# Altium schematic sheet fpga-bank6.SchDoc: CS - FPGA - Bank 6
size Letter; CheckedBy: J. Brinton; CompanyName: Signal Laboratories, Inc.; DrawnBy: J. Brinton; Engineer: J. Brinton; Address1: 3479 Edison Way; Address2: Menlo Park CA 94025; Address3: +1 (877) 778-8435; Address4: siglabs.com; Revision: 3; SheetNumber: 10; SheetTotal: 47
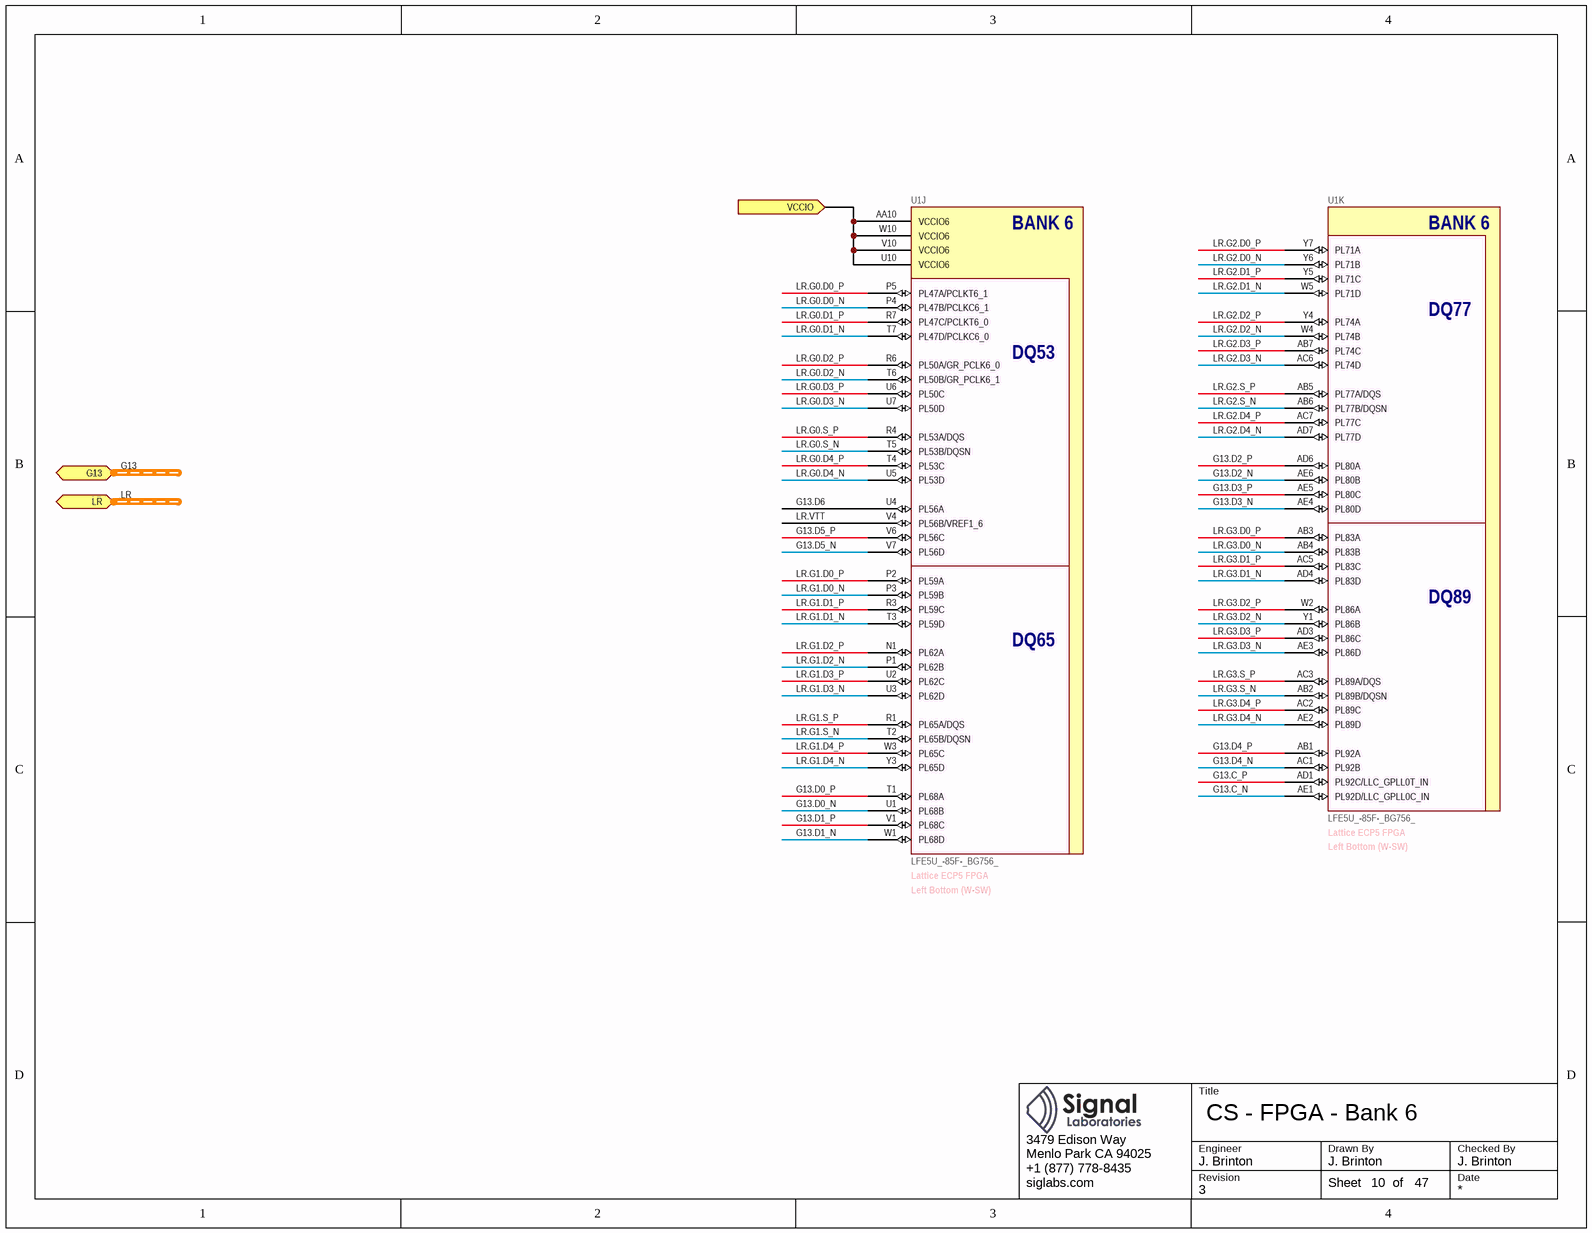
[diagram p0: fpga-bank6.SchDoc]

## Parts
U1  LFE5U_-85F-_BG756_  [caBGA756]  (parts J,K of 19)

## Ports
G13 (harness GPIO13), LR (harness DDR), VCCIO (in)

## Nets
G13.C_N: U1.AE1(PL92D/LLC_GPLL0C_IN)
G13.C_P: U1.AD1(PL92C/LLC_GPLL0T_IN)
G13.D0_N: U1.U1(PL68B)
G13.D0_P: U1.T1(PL68A)
G13.D1_N: U1.W1(PL68D)
G13.D1_P: U1.V1(PL68C)
G13.D2_N: U1.AE6(PL80B)
G13.D2_P: U1.AD6(PL80A)
G13.D3_N: U1.AE4(PL80D)
G13.D3_P: U1.AE5(PL80C)
G13.D4_N: U1.AC1(PL92B)
G13.D4_P: U1.AB1(PL92A)
G13.D5_N: U1.V7(PL56D)
G13.D5_P: U1.V6(PL56C)
G13.D6: U1.U4(PL56A)
LR.G0.D0_N: U1.P4(PL47B/PCLKC6_1)
LR.G0.D0_P: U1.P5(PL47A/PCLKT6_1)
LR.G0.D1_N: U1.T7(PL47D/PCLKC6_0)
LR.G0.D1_P: U1.R7(PL47C/PCLKT6_0)
LR.G0.D2_N: U1.T6(PL50B/GR_PCLK6_1)
LR.G0.D2_P: U1.R6(PL50A/GR_PCLK6_0)
LR.G0.D3_N: U1.U7(PL50D)
LR.G0.D3_P: U1.U6(PL50C)
LR.G0.D4_N: U1.U5(PL53D)
LR.G0.D4_P: U1.T4(PL53C)
LR.G0.S_N: U1.T5(PL53B/DQSN)
LR.G0.S_P: U1.R4(PL53A/DQS)
LR.G1.D0_N: U1.P3(PL59B)
LR.G1.D0_P: U1.P2(PL59A)
LR.G1.D1_N: U1.T3(PL59D)
LR.G1.D1_P: U1.R3(PL59C)
LR.G1.D2_N: U1.P1(PL62B)
LR.G1.D2_P: U1.N1(PL62A)
LR.G1.D3_N: U1.U3(PL62D)
LR.G1.D3_P: U1.U2(PL62C)
LR.G1.D4_N: U1.Y3(PL65D)
LR.G1.D4_P: U1.W3(PL65C)
LR.G1.S_N: U1.T2(PL65B/DQSN)
LR.G1.S_P: U1.R1(PL65A/DQS)
LR.G2.D0_N: U1.Y6(PL71B)
LR.G2.D0_P: U1.Y7(PL71A)
LR.G2.D1_N: U1.W5(PL71D)
LR.G2.D1_P: U1.Y5(PL71C)
LR.G2.D2_N: U1.W4(PL74B)
LR.G2.D2_P: U1.Y4(PL74A)
LR.G2.D3_N: U1.AC6(PL74D)
LR.G2.D3_P: U1.AB7(PL74C)
LR.G2.D4_N: U1.AD7(PL77D)
LR.G2.D4_P: U1.AC7(PL77C)
LR.G2.S_N: U1.AB6(PL77B/DQSN)
LR.G2.S_P: U1.AB5(PL77A/DQS)
LR.G3.D0_N: U1.AB4(PL83B)
LR.G3.D0_P: U1.AB3(PL83A)
LR.G3.D1_N: U1.AD4(PL83D)
LR.G3.D1_P: U1.AC5(PL83C)
LR.G3.D2_N: U1.Y1(PL86B)
LR.G3.D2_P: U1.W2(PL86A)
LR.G3.D3_N: U1.AE3(PL86D)
LR.G3.D3_P: U1.AD3(PL86C)
LR.G3.D4_N: U1.AE2(PL89D)
LR.G3.D4_P: U1.AC2(PL89C)
LR.G3.S_N: U1.AB2(PL89B/DQSN)
LR.G3.S_P: U1.AC3(PL89A/DQS)
LR.VTT: U1.V4(PL56B/VREF1_6)
VCCIO: U1.AA10(VCCIO6) U1.U10(VCCIO6) U1.V10(VCCIO6) U1.W10(VCCIO6) ; port VCCIO

## Buses and harness runs
harness G13 = port G13
harness LR = port LR

## Notes on the sheet
- (near U1) Left Bottom (W-SW)
- (near U1) Lattice ECP5 FPGA
- Title
- Engineer
- Revision
- Drawn By
- Checked By
- Date
- Sheet
- of
- (in symbol LFE5U_-85F-_BG756_, part J) BANK 6; DQ53; DQ65
- (in symbol LFE5U_-85F-_BG756_, part K) BANK 6; DQ77; DQ89

## Library data of the parts
U1 = LFE5U_-85F-_BG756_: ECP5 FPGA, 85k LUT, 756-caBGA; Manufacturer: Lattice Semiconductor; Manufacturer P/N: LFE5U_-85F-_BG756_